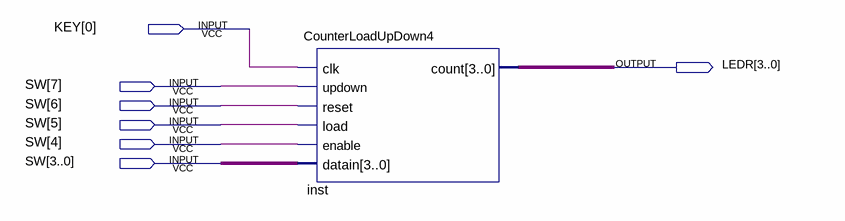
[diagram p0: schematic sheet]
// Quartus schematic CounterLoad_Demo.bdf as structural Verilog: 1 symbols, 7 pins
module CounterLoad_Demo (
  input  [0:0] KEY,
  input  [7:0] SW,
  output [3:0] LEDR
);

  CounterLoadUpDown4 inst (
    .clk(KEY[0]), .updown(SW[7]), .reset(SW[6]), .load(SW[5]), .enable(SW[4]), .datain(SW[3:0]), .count(LEDR));
endmodule
